# Altium schematic sheet CM_MOTOR.SchDoc
size Tabloid; SheetNumber: 10; SheetTotal: 14; Sheet_Name: CM_MOTOR; Size: 11x17
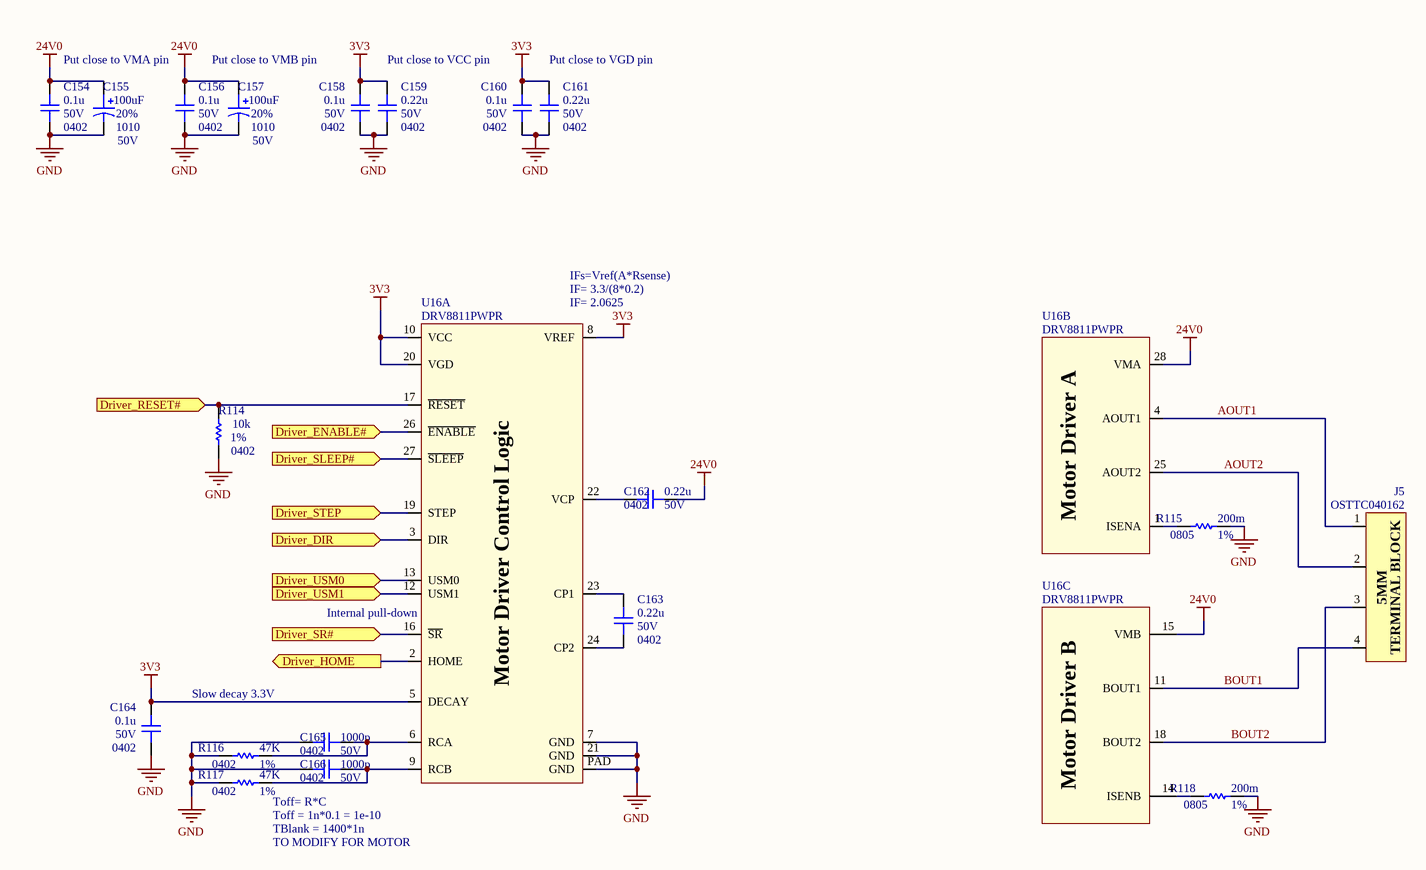
[diagram p0: CM_MOTOR.SchDoc]

## Parts
C154  value 0.1u  Voltage: 50V  Package: 0402  [CAP_0402]  (hidden comment: CAP - 0402)
C155  value 100uF  Voltage: 50V  Package: 1010  Precision: 20%  [CAP_ALU_1010_vishay]  (hidden comment: MAL215099101E3)
C156  value 0.1u  Voltage: 50V  Package: 0402  [CAP_0402]  (hidden comment: CAP - 0402)
C157  value 100uF  Voltage: 50V  Package: 1010  Precision: 20%  [CAP_ALU_1010_vishay]  (hidden comment: MAL215099101E3)
C158  value 0.1u  Voltage: 50V  Package: 0402  [CAP_0402]  (hidden comment: CAP - 0402)
C159  value 0.22u  Voltage: 50V  Package: 0402  [CAP_0402]  (hidden comment: CAP - 0402)
C160  value 0.1u  Voltage: 50V  Package: 0402  [CAP_0402]  (hidden comment: CAP - 0402)
C161  value 0.22u  Voltage: 50V  Package: 0402  [CAP_0402]  (hidden comment: CAP - 0402)
C162  value 0.22u  Voltage: 50V  Package: 0402  [CAP_0402]  (hidden comment: CAP - 0402)
C163  value 0.22u  Voltage: 50V  Package: 0402  [CAP_0402]  (hidden comment: CAP - 0402)
C164  value 0.1u  Voltage: 50V  Package: 0402  [CAP_0402]  (hidden comment: CAP - 0402)
C165  value 1000p  Voltage: 50V  Package: 0402  [CAP_0402]  (hidden comment: CAP - 0402)
C166  value 1000p  Voltage: 50V  Package: 0402  [CAP_0402]  (hidden comment: CAP - 0402)
J5  OSTTC040162  [CONN_TERMINAL_OSTTA040161]
R114  value 10k  Package: 0402  Precision: 1%  [RES_0402]  (hidden comment: RES - 0402)
R115  value 200m  Package: 0805  Precision: 1%  [RES_0402]  (hidden comment: RES - 0402)
R116  value 47K  Package: 0402  Precision: 1%  [RES_0402]  (hidden comment: RES - 0402)
R117  value 47K  Package: 0402  Precision: 1%  [RES_0402]  (hidden comment: RES - 0402)
R118  value 200m  Package: 0805  Precision: 1%  [RES_0402]  (hidden comment: RES - 0402)
U16  DRV8811PWPR  [POW_MOTOR_DRV8811PWPR]  (parts A,B,C of 3)

## Ports
Driver_DIR (in), Driver_ENABLE# (in), Driver_HOME (out), Driver_RESET# (in), Driver_SLEEP# (in), Driver_SR# (in), Driver_STEP (in), Driver_USM0 (in), Driver_USM1 (in)

## Nets
3V3: C158.2 C159.2 C160.2 C161.2 C164.2 U16.5(DECAY) U16.8(VREF) U16.10(VCC) U16.20(VGD)
24V0: C154.2 C155.1 C156.2 C157.1 C162.2 U16.15(VMB) U16.28(VMA)
GND: C154.1 C155.2 C156.1 C157.2 C158.1 C159.1 C160.1 C161.1 C164.1 C165.2 C166.2 R114.1 R115.2 R116.1 R117.1 R118.2 U16.7(GND) U16.21(GND) U16.PAD(GND)
AOUT1: J5.1 U16.4(AOUT1)
AOUT2: J5.2 U16.25(AOUT2)
BOUT1: J5.4 U16.11(BOUT1)
BOUT2: J5.3 U16.18(BOUT2)
Driver_DIR: U16.3(DIR) ; port Driver_DIR
Driver_ENABLE#: U16.26(~{ENABLE}) ; port Driver_ENABLE#
Driver_HOME: U16.2(HOME) ; port Driver_HOME
Driver_RESET#: R114.2 U16.17(~{RESET}) ; port Driver_RESET#
Driver_SLEEP#: U16.27(~{SLEEP}) ; port Driver_SLEEP#
Driver_SR#: U16.16(~{SR}) ; port Driver_SR#
Driver_STEP: U16.19(STEP) ; port Driver_STEP
Driver_USM0: U16.13(USM0) ; port Driver_USM0
Driver_USM1: U16.12(USM1) ; port Driver_USM1
NetC162_1: C162.1 U16.22(VCP)
NetC163_1: C163.1 U16.24(CP2)
NetC163_2: C163.2 U16.23(CP1)
NetC165_1: C165.1 R116.2 U16.6(RCA)
NetC166_1: C166.1 R117.2 U16.9(RCB)
NetR115_1: R115.1 U16.1(ISENA)
NetR118_1: R118.1 U16.14(ISENB)

## Notes on the sheet
- Put close to VMA pin
- Put close to VMB pin
- Put close to VCC pin
- Put close to VGD pin
- IFs=Vref(A*Rsense)
- (near U16) IF= 3.3/(8*0.2)
- (near U16) IF= 2.0625
- (near U16) Internal pull-down
- Slow decay 3.3V
- Toff= R*C
- Toff = 1n*0.1 = 1e-10
- TBlank = 1400*1n
- TO MODIFY FOR MOTOR
- Sheet Name
- Project Title
- Global Project
- Size
- Group
- Revision
- Date
- Sheet
- of
- Filename
- Designers
- (in symbol CONN_TERMINAL_OSTTC040162) 5MM; TERMINAL BLOCK
- (in symbol POW_MOTOR_DRV8811PWPR, part A) Motor Driver Control Logic
- (in symbol POW_MOTOR_DRV8811PWPR, part B) Motor Driver A
- (in symbol POW_MOTOR_DRV8811PWPR, part C) Motor Driver B

## Library data of the parts
C154 C156 C158-C166 = CAP - 0402: Precision: 10%; Current: *; CreatedBy: Jonathan Bouchard; Power: *
C155 C157 = CAP_ALU_MAL215099101E3: CAP - ALU 100uF 20% 50V - 1010; Current: 490mA; Mfg: Vishay Dale; Mfg Part Number: MAL215099101E3; HelpURL: http://www.vishay.com/docs/28395/150crz.pdf; CreatedBy: Jonathan Bouchard; Temperature: -55°C to 125°C; Power: *; Supplier 1: Digikey; Supplier Part Number 1: 4399PHDKR-ND
J5 = CONN_TERMINAL_OSTTC040162: CONN -  TERMINAL BLOCK 4POS 5MM - TH; Mfg: On Shore Technology Inc.; Voltage: *; Current: *; Power: *; Mfg Part Number: OSTTC040162; HelpURL: http://www.on-shore.com/wp-content/uploads/2015/09/osttcxx0162.pdf; CreatedBy: Jonathan Bouchard; Temperature: -30°C ~ 105°C; Value: *; Precision: *; Package: TH-4; Supplier 1: Digikey; Supplier Part Number 1: ED2602-ND
R114-R118 = RES - 0402: Voltage: 50V; Power: 1/16W; Current: *; CreatedBy: Jonathan Bouchard
U16 = POW_MOTOR_DRV8811PWPR: POW - STEPPER MOTOR DRIVER - SOP-28; Voltage: 3 V ~ 5.5 V / 8 V ~ 38 V; Mfg: Texas Instrument; Current: *; Power: *; Mfg Part Number: DRV8811PWPR; HelpURL: http://www.ti.com/lit/ds/symlink/drv8811.pdf; CreatedBy: Jonathan Bouchard; Temperature: -40°C ~ 150°C (TJ); Value: *; Precision: *; Package: SOP-28; Supplier 1: Digikey; Supplier Part Number 1: 296-24591-1-ND